# EAGLE schematic driver (EAGLE 6.5.0)
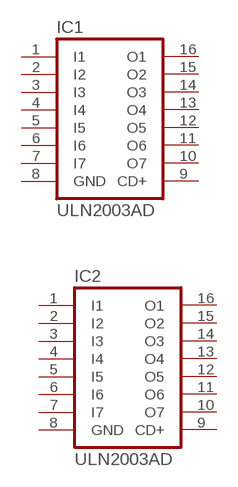
[diagram p0: schematic, sheet 1]

## Parts
IC1  ULN2003AD  [SO16]
IC2  ULN2003AD  [SO16]
Unconnected: IC1.1(I1) IC1.2(I2) IC1.3(I3) IC1.4(I4) IC1.5(I5) IC1.6(I6) IC1.7(I7) IC1.9(CD+) IC1.10(O7) IC1.11(O6) IC1.12(O5) IC1.13(O4) IC1.14(O3) IC1.15(O2) IC1.16(O1) IC2.1(I1) IC2.2(I2) IC2.3(I3) IC2.4(I4) IC2.5(I5) IC2.6(I6) IC2.7(I7) IC2.9(CD+) IC2.10(O7) IC2.11(O6) IC2.12(O5) IC2.13(O4) IC2.14(O3) IC2.15(O2) IC2.16(O1)

## Power pins joined to a net without a drawn wire
GND: IC1.8(GND) IC2.8(GND)

## Library data of the parts
IC1 IC2 = uln-udn:ULN2003A: DRIVER ARRAY